# Altium project Adapter.PrjPcb
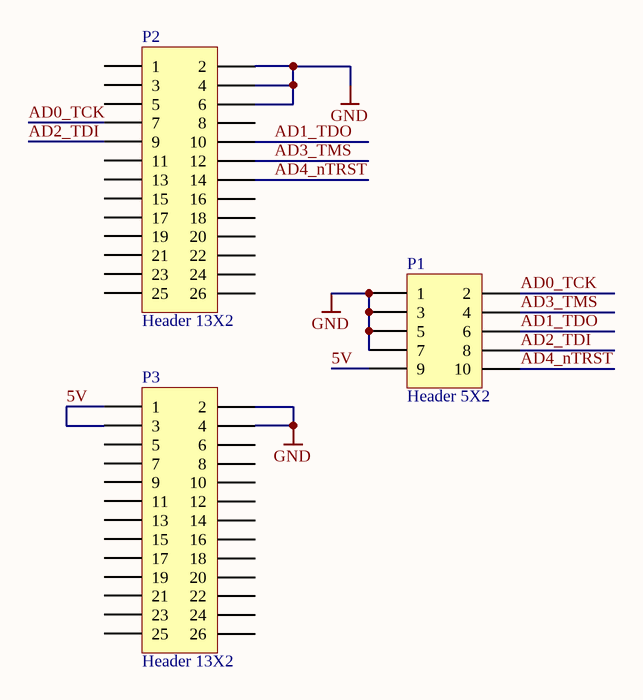
[diagram p0: Sheet1.SchDoc]
1 sheet, 3 parts. Net scope: global (net labels, ports and power ports of the same name join across sheets).
Board file: PCB1.PcbDoc

## Sheet Sheet1.SchDoc
size A2; Organization: Altium Limited; Address1: L3, 12a Rodborough Rd; Address2: Frenchs Forest; Address3: NSW; Address4: Australia 2086

### Parts
P1  Header 5X2  [HDR2X5]
P2  Header 13X2  [HDR2X13]
P3  Header 13X2  [HDR2X13]

### Nets
GND: P1.1 P1.3 P1.5 P1.7 P2.2 P2.4 P2.6 P3.2 P3.4
5V: P1.9 P3.1 P3.3
AD0_TCK: P1.2 P2.7
AD1_TDO: P1.6 P2.10
AD2_TDI: P1.8 P2.9
AD3_TMS: P1.4 P2.12
AD4_nTRST: P1.10 P2.14

Not connected (* = marked no-connect by the designer): P2 1 3 5 8 11 13 15 16 17 18 19 20 21 22 23 24 25 26; P3 5 6 7 8 9 10 11 12 13 14 15 16 17 18 19 20 21 22 23 24 25 26

### Notes on the sheet
- Title
- Size:
- Date:
- File:
- A2
- Number:
- Time:
- Revision:
- Sheet
- of

### Library data of the parts
P1 = Header 5X2: Header, 5-Pin, Dual row; LatestRevisionDate: 17-Jul-2002; LatestRevisionNote: Re-released for DXP Platform.; Publisher: Altium Limited
P2 P3 = Header 13X2: Header, 13-Pin, Dual row; LatestRevisionDate: 17-Jul-2002; LatestRevisionNote: Re-released for DXP Platform.; Publisher: Altium Limited